# Altium schematic sheet BM_EXT_PWR.SchDoc
size A4; SheetNumber: 6; SheetTotal: 15
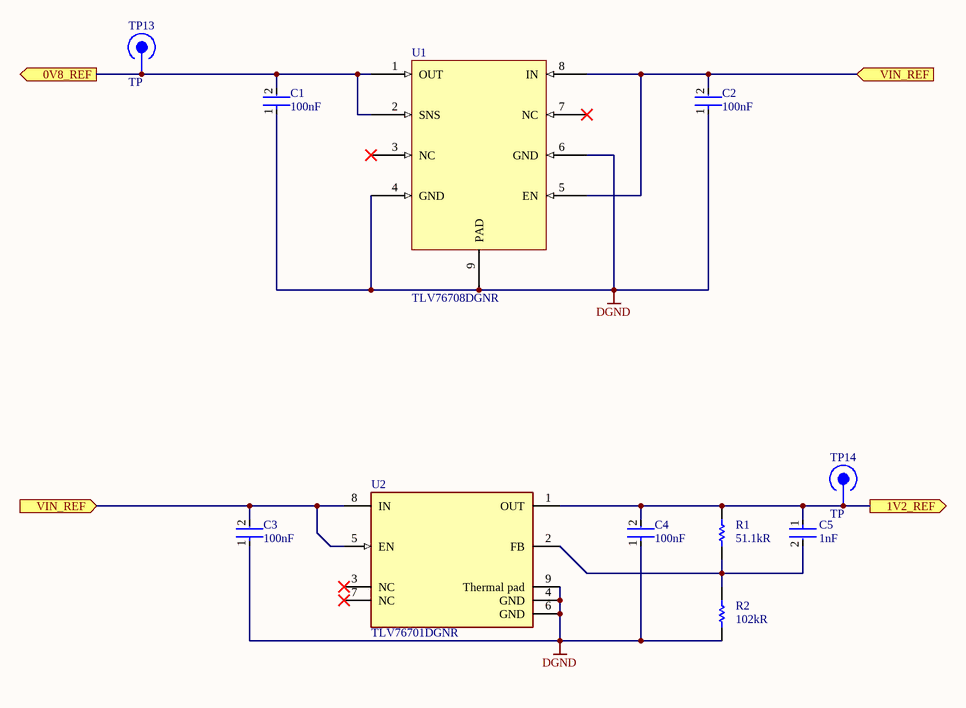
[diagram p0: BM_EXT_PWR.SchDoc]

## Parts
C1  value 100nF  [FP-CC0402-IPC_B]  (hidden comment: CC0402KRX7R9BB104)
C2  value 100nF  [FP-CC0402-IPC_B]  (hidden comment: CC0402KRX7R9BB104)
C3  value 100nF  [FP-CC0402-IPC_B]  (hidden comment: CC0402KRX7R9BB104)
C4  value 100nF  [FP-CC0402-IPC_B]  (hidden comment: CC0402KRX7R9BB104)
C5  value 1nF  [FP-CC0805-0_85-MFG]  (hidden comment: CC0805KRX7R9BB102)
R1  value 51.1kR  [RESC1005X40X25LL10T10]  (hidden comment: RK73H1ETTP5112F)
R2  value 102kR  [RESC1005X40X25LL10T10]  (hidden comment: RK73H1ETTP1023F)
TP13  TP  [TP-Footprint-1]
TP14  TP  [TP-Footprint-1]
U1  TLV76708DGNR  [TLV76708DGNR-Footprint-1]
U2  TLV76701DGNR  [FP-DGN0008G-MFG]

## Ports
0V8_REF (out), 1V2_REF (out), VIN_REF (in)

## Nets
DGND: C1.1 C2.1 C3.1 C4.1 R2.1 U1.4(GND) U1.6(GND) U1.9(PAD) U2.4(GND) U2.6(GND) U2.9(Thermal_pad)
0V8_REF: C1.2 TP13.1 U1.1(OUT) U1.2(SNS) ; port 0V8_REF
1V2_REF: C4.2 C5.1 R1.2 TP14.1 U2.1(OUT) ; port 1V2_REF
VIN_REF: C2.2 C3.2 U1.5(EN) U1.8(IN) U2.5(EN) U2.8(IN) ; port VIN_REF
NetC5_2: C5.2 R1.1 R2.2 U2.2(FB)

Not connected (* = marked no-connect by the designer): U1 3(NC)* 7(NC)*; U2 3(NC)* 7(NC)*

## Library data of the parts
C1-C4 = CMP-x00152-1: Ceramic Capacitor, Multilayer, Ceramic, 50V, 10% +Tol, 10% -Tol, X7R, 15% TC, 0.1uF, Surface Mount, 0402
C5 = CMP-x00143-1: Ceramic Capacitor, Multilayer, Ceramic, 50V, 10% +Tol, 10% -Tol, X7R, 15% TC, 0.001uF, Surface Mount, 0805; Category: Capacitor
R1 = CMP-x00159-1: Fixed Resistor, Metal Glaze/thick Film, 0.1W, 51100ohm, 75V, 1% +/-Tol, 100ppm/Cel, Surface Mount, 0402
R2 = CMP-x00160-1: Fixed Resistor, Metal Glaze/thick Film, 0.1W, 102000ohm, 75V, 1% +/-Tol, 100ppm/Cel, Surface Mount, 0402
TP13 TP14 = CMP-001-0086-3: digital shovel test point
U1 = CMP-x00161-1: Adjustable- and fixed-output, 1-A, 16-V, positive-voltage low-dropout (LDO) linear regulator 8-HVSSOP -40 to 125
U2 = CMP-x00158-1: Adjustable Positive Standard Regulator, 0.8V Min, 13.6V Max, PDSO8